# Altium schematic sheet GSM_GPS.SchDoc
size A4
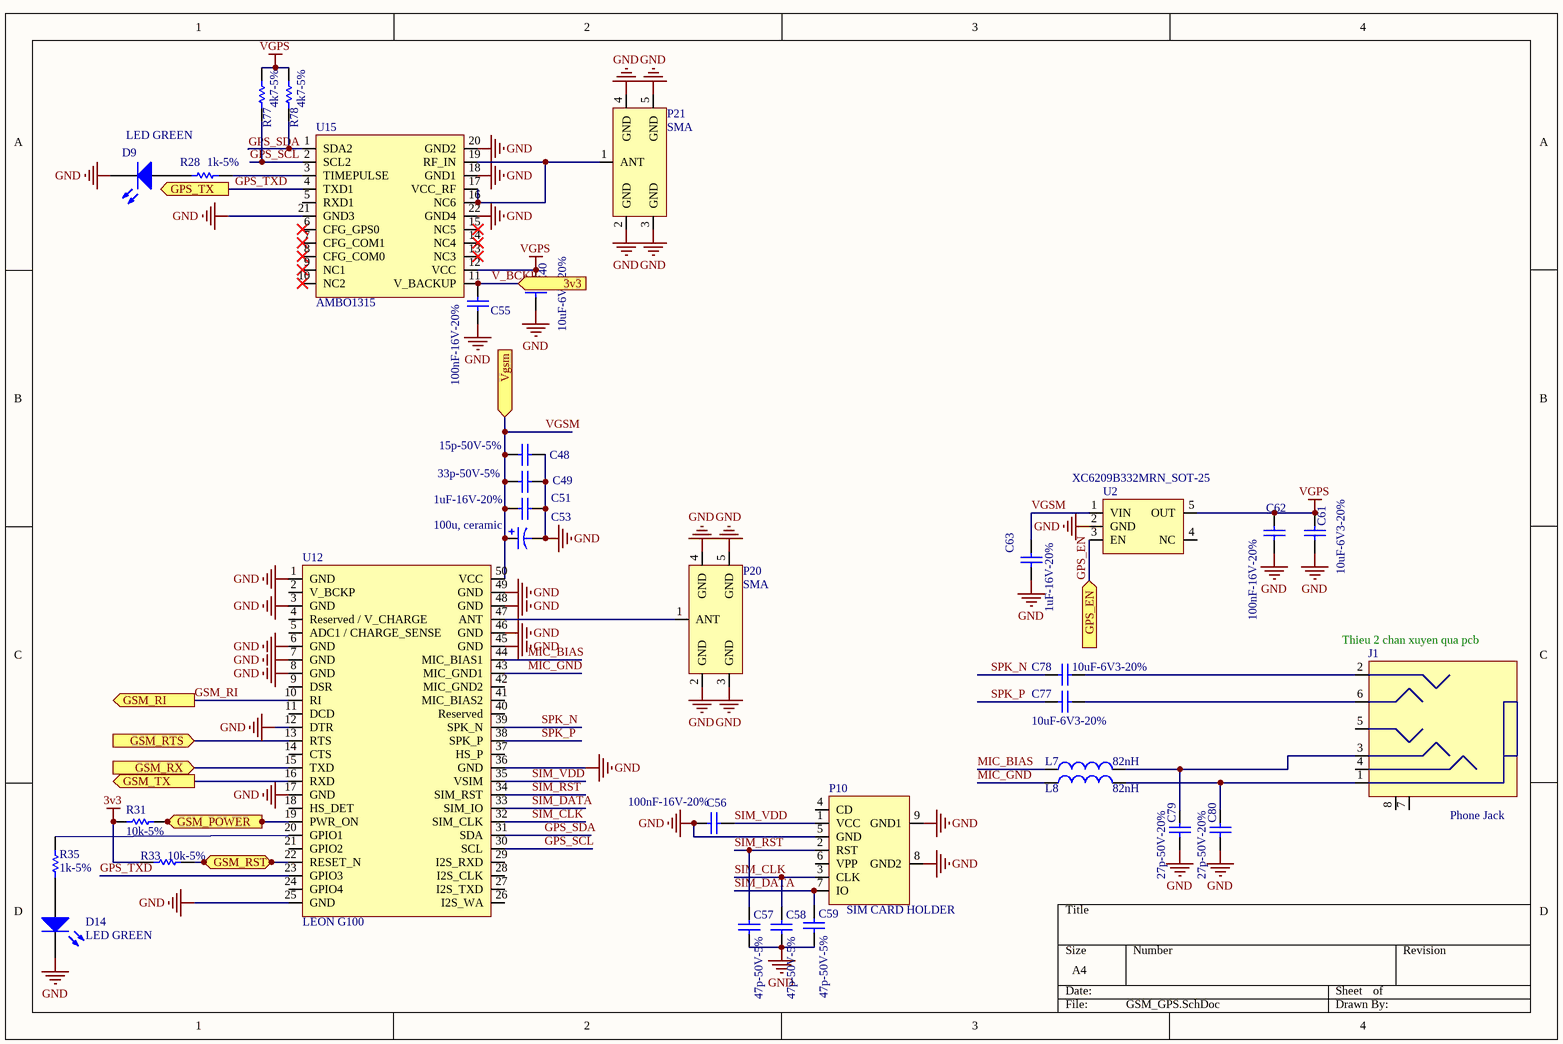
[diagram p0: GSM_GPS.SchDoc]

## Parts
C40  10uF-6V3-20%  [C0603]
C48  15p-50V-5%  [C0402]
C49  33p-50V-5%  [C0402]
C51  1uF-16V-20%  [C0603]
C53  100u, ceramic  [C1210]
C55  100nF-16V-20%  [C0402]
C56  100nF-16V-20%  [C0402]
C57  47p-50V-5%  [C0402]
C58  47p-50V-5%  [C0402]
C59  47p-50V-5%  [C0402]
C61  10uF-6V3-20%  [C0603]
C62  100nF-16V-20%  [C0402]
C63  1uF-16V-20%  [C0603]
C77  10uF-6V3-20%  [C0603]
C78  10uF-6V3-20%  [C0603]
C79  27p-50V-20%  [C0402]
C80  27p-50V-20%  [C0402]
D9  LED GREEN  [LED0603-G]
D14  LED GREEN  [LED0603-G]
J1  Phone Jack  [PHONE JACK]
L7  82nH  [R0402]
L8  82nH  [R0402]
P10  SIM CARD HOLDER  [SIM CARD HOLDER]
P20  SMA  [ANTENA-SMA]
P21  SMA  [ANTENA-SMA]
R28  1k-5%  [R0402]
R31  10k-5%  [R0402]
R33  10k-5%  [R0402]
R35  1k-5%  [R0402]
R77  4k7-5%  [R0402]
R78  4k7-5%  [R0402]
U2  XC6209B332MRN_SOT-25  [SOT23-5]
U12  LEON G100  [UBLOX]
U15  AMBO1315  [GPS-module]

## Ports
3v3 (in), GPS_EN (in), GPS_TX (out), GSM_POWER (in), GSM_RI (out), GSM_RST (in), GSM_RTS (in), GSM_RX (in), GSM_TX (out), Vgsm (in)

## Nets
3v3: R31.1 R33.1
GND: C40.1 C48.2 C49.2 C51.1 C53.2 C55.1 C56.2 C57.1 C58.1 C59.1 C61.1 C62.1 C63.1 C79.2 C80.2 D9.2(K) D14.2(K) P10.5(GND) P10.8(GND2) P10.9(GND1) P20.2(GND) P20.3(GND) P20.4(GND) P20.5(GND) P21.2(GND) P21.3(GND) P21.4(GND) P21.5(GND) U2.2(GND) U12.1(GND) U12.3(GND) U12.6(GND) U12.7(GND) U12.8(GND) U12.12(DTR) U12.17(GND) U12.25(GND) U12.36(GND) U12.45(GND) U12.46(GND) U12.48(GND) U12.49(GND) U15.18(GND1) U15.20(GND2) U15.21(GND3) U15.22(GND4)
VGPS: C40.2 C61.2 C62.2 R77.2 R78.2 U2.5(OUT) U15.12(VCC)
GPS_EN: U2.3(EN) ; port GPS_EN
GPS_SCL: R77.1 U12.30(SCL) U15.2(SCL2)
GPS_SDA: R78.1 U12.31(SDA) U15.1(SDA2)
GPS_TXD: U12.23(GPIO3) U15.4(TXD1) ; port GPS_TX
GSM_POWER: R31.2 U12.19(PWR_ON) ; port GSM_POWER
GSM_RI: U12.10(RI) ; port GSM_RI
GSM_RST: R33.2 U12.22(RESET_N) ; port GSM_RST
GSM_RTS: U12.13(RTS) ; port GSM_RTS
GSM_RX: U12.15(TXD) ; port GSM_RX
GSM_TX: U12.16(RXD) ; port GSM_TX
MIC_BIAS: L7.1 U12.44(MIC_BIAS1)
MIC_GND: L8.1 U12.43(MIC_GND1)
SIM_CLK: C58.2 P10.3(CLK) U12.32(SIM_CLK)
SIM_DATA: C59.2 P10.7(IO) U12.33(SIM_IO)
SIM_RST: C57.2 P10.2(RST) U12.34(SIM_RST)
SIM_VDD: C56.1 P10.1(VCC) U12.35(VSIM)
SPK_N: C78.2 U12.39(SPK_N)
SPK_P: C77.2 U12.38(SPK_P)
V_BCKP: C55.2 U15.11(V_BACKUP) ; port 3v3
VGSM: C48.1 C49.1 C51.2 C53.1 C63.2 U2.1(VIN) U12.50(VCC) ; port Vgsm
NetC77_1: C77.1 J1.6
NetC78_1: C78.1 J1.2
NetC79_1: C79.1 J1.3 L7.2
NetC80_1: C80.1 J1.1 L8.2
NetD9_1: D9.1(A) R28.2
NetD14_1: D14.1(A) R35.1
NetP20_1: P20.1(ANT) U12.47(ANT)
NetP21_1: P21.1(ANT) U15.16(NC6) U15.17(VCC_RF) U15.19(RF_IN)
NetR28_1: R28.1 U15.3(TIMEPULSE)
NetR35_2: R35.2 U12.20(GPIO1)

Not connected (* = marked no-connect by the designer): J1 4 5 7 8; P10 4(CD) 6(VPP); U2 4(NC); U12 2(V_BCKP) 4(Reserved_/_V_CHARGE) 5(ADC1_/_CHARGE_SENSE) 9(DSR) 11(DCD) 14(CTS) 18(HS_DET) 21(GPIO2) 24(GPIO4) 26(I2S_WA) 27(I2S_TXD) 28(I2S_CLK) 29(I2S_RXD) 37(HS_P) 40(Reserved) 41(MIC_BIAS2) 42(MIC_GND2); U15 5(RXD1) 6(CFG_GPS0)* 7(CFG_COM1)* 8(CFG_COM0)* 9(NC1)* 10(NC2)* 13(NC3)* 14(NC4)* 15(NC5)*

## Notes on the sheet
- (near J1) Thieu 2 chan xuyen qua pcb

## Library data of the parts
C40 C61 C77 C78 = Cap: CAP CER 10UF 6.3V 20% X5R 0603; Manufacturer: Murata Electronics North America; Manufacturer Part Number: GRM188R60J106ME47D; Published: 8-Jun-2000; LatestRevisionDate: 17-Jul-2002; LatestRevisionNote: Re-released for DXP Platform.; PackageReference: C0603; Publisher: Altium Limited; Value: 10uF-6V3-20%; Digi-Key Part Number: 490-3896-1-ND; Unit Price: 0.07873
C48 = Cap: CAP CER 15PF 50V 5% NPO 0402; Manufacturer: Yageo; Manufacturer Part Number: CC0402JRNPO9BN150; Published: 8-Jun-2000; LatestRevisionDate: 17-Jul-2002; LatestRevisionNote: Re-released for DXP Platform.; PackageReference: C0402; Publisher: Altium Limited; Value: 15p-50V-5%; Digi-Key Part Number: 311-1017-1-ND; Unit Price: 0.00270
C49 = Cap: CAP CER 33PF 50V 5% NPO 0402; Manufacturer: Yageo; Manufacturer Part Number: CC0402JRNPO9BN330; Published: 8-Jun-2000; LatestRevisionDate: 17-Jul-2002; LatestRevisionNote: Re-released for DXP Platform.; PackageReference: C0603; Publisher: Altium Limited; Value: 33p-50V-5%; Digi-Key Part Number: 311-1020-1-ND; Unit Price: 0.00270
C51 C63 = Cap: CAP CER 1UF 16V Y5V 0603; Manufacturer: Yageo; Manufacturer Part Number: CC0603ZRY5V7BB105; Published: 8-Jun-2000; LatestRevisionDate: 17-Jul-2002; LatestRevisionNote: Re-released for DXP Platform.; PackageReference: C0603; Publisher: Altium Limited; Value: 1uF-16V-20%; Digi-Key Part Number: 311-1372-1-ND; Unit Price: 0.00465
C53 = Cap Pol3: CAP CER 100UF 10V 20% X5R 1812; Manufacturer Part Number: C4532X5R1A107M; Manufacturer: TDK Corporation; Published: 8-Jun-2000; LatestRevisionDate: 29-May-2009; LatestRevisionNote: IPC-7351 Footprint Added.; PackageReference: C0805; Publisher: Altium Limited; PackageDescription: Chip Capacitor; Digi-Key Part Number: 445-7743-2-ND; Unit Price: 0.55800
C55 C56 C62 = Cap: CAP CER 0.1UF 16V Y5V 0402; Manufacturer: Yageo; Manufacturer Part Number: CC0402ZRY5V7BB104; Published: 8-Jun-2000; LatestRevisionDate: 17-Jul-2002; LatestRevisionNote: Re-released for DXP Platform.; PackageReference: C0402; Publisher: Altium Limited; Value: 100nF-16V-20%; Digi-Key Part Number: 311-1047-1-ND; Unit Price: 0.00250
C57-C59 = Cap: CAP CER 47PF 50V 5% NPO 0402; Manufacturer: Yageo; Manufacturer Part Number: CC0402JRNPO9BN470; Published: 8-Jun-2000; LatestRevisionDate: 17-Jul-2002; LatestRevisionNote: Re-released for DXP Platform.; PackageReference: C0603; Publisher: Altium Limited; Value: 47p-50V-5%; Digi-Key Part Number: 311-1021-1-ND; Unit Price: 0.00270
C79 C80 = Cap: CAP CER 27PF 50V 5% NPO 0402; Manufacturer: Murata Electronics North America; Manufacturer Part Number: GRM1555C1H270JA01D; Published: 8-Jun-2000; LatestRevisionDate: 17-Jul-2002; LatestRevisionNote: Re-released for DXP Platform.; PackageReference: C0603; Publisher: Altium Limited; Value: 27p-50V-20%; Digi-Key Part Number: 490-5869-1-ND; Unit Price: 0.00270
D9 D14 = LED2: LED GREEN CLEAR THIN 0603 SMD; Manufacturer: Lite-On Inc; Manufacturer Part Number: LTST-C191KGKT; Published: 8-Jun-2000; LatestRevisionDate: 17-Jul-2002; LatestRevisionNote: Re-released for DXP Platform.; PackageVersion: Feb-2002; PackageReference: 3.2X1.6X1.1; Publisher: Altium Limited; Digi-Key Part Number: 160-1446-2-ND; Unit Price: 0.03780; Value: LED GREEN
J1 = Phone Jack: NA; Manufacturer: tyrone
L7 L8 = Inductor: INDUCTOR 82NH 150MA 0402; Manufacturer Part Number: LQG15HS82NJ02D; Manufacturer: Murata Electronics North America; Code_IEC: 1005; Published: 8-Jun-2000; LatestRevisionDate: 29-May-2009; LatestRevisionNote: IPC-7351 Footprint Added.; PackageReference: 0402-A; Publisher: Altium Limited; PackageDescription: Chip Inductor; Code_JEITA: 0402; Value: 82nH; Digi-Key Part Number: 490-2634-1-ND
P10 = SIM CARD
P20 P21 = Component_1: SMA-R/A-F; Unit Price: 0.5
R28 R35 = Res1: RES 1.0K OHM 1/16W 5% 0402 SMD; Manufacturer: Yageo; Manufacturer Part Number: RC0402JR-071KL; Published: 8-Jun-2000; LatestRevisionDate: 17-Jul-2002; LatestRevisionNote: Re-released for DXP Platform.; PackageReference: R0603; Publisher: Altium Limited; Value: 1k-5%; Digi-Key Part Number: 311-1.0KJRCT-ND; Unit Price: 0.00178
R31 R33 = Res1: RES 10K OHM 1/16W 5% 0402 SMD; Manufacturer: Yageo; Manufacturer Part Number: RC0402JR-0710KL; Description: RES 10K OHM 1/10W 5% 0603 SMD; Published: 8-Jun-2000; LatestRevisionDate: 17-Jul-2002; LatestRevisionNote: Re-released for DXP Platform.; PackageReference: R0603; Publisher: Altium Limited; Value: 10k-5%; Digi-Key Part Number: 311-10KJRCT-ND; Unit Price: 0.00178
R77 R78 = Res1: RES 4.7K OHM 1/16W 5% 0402 SMD; Manufacturer: Yageo; Manufacturer Part Number: RC0402JR-074K7L; Description: RES 10K OHM 1/10W 5% 0603 SMD; Published: 8-Jun-2000; LatestRevisionDate: 17-Jul-2002; LatestRevisionNote: Re-released for DXP Platform.; PackageReference: R0603; Publisher: Altium Limited; Value: 4k7-5%; Digi-Key Part Number: 311-4.7KJRCT-ND; Unit Price: 0.00178
U2 = XC6209B332MRN_SOT-25: Manufacturer: Tyrone
U12 = ublox: Manufacturer: Tyrone
U15 = UBLOX-GPS: Manufacturer: Tyrone